# Altium schematic sheet Sheet1.SchDoc
size A3; SheetNumber: 1; SheetTotal: 1
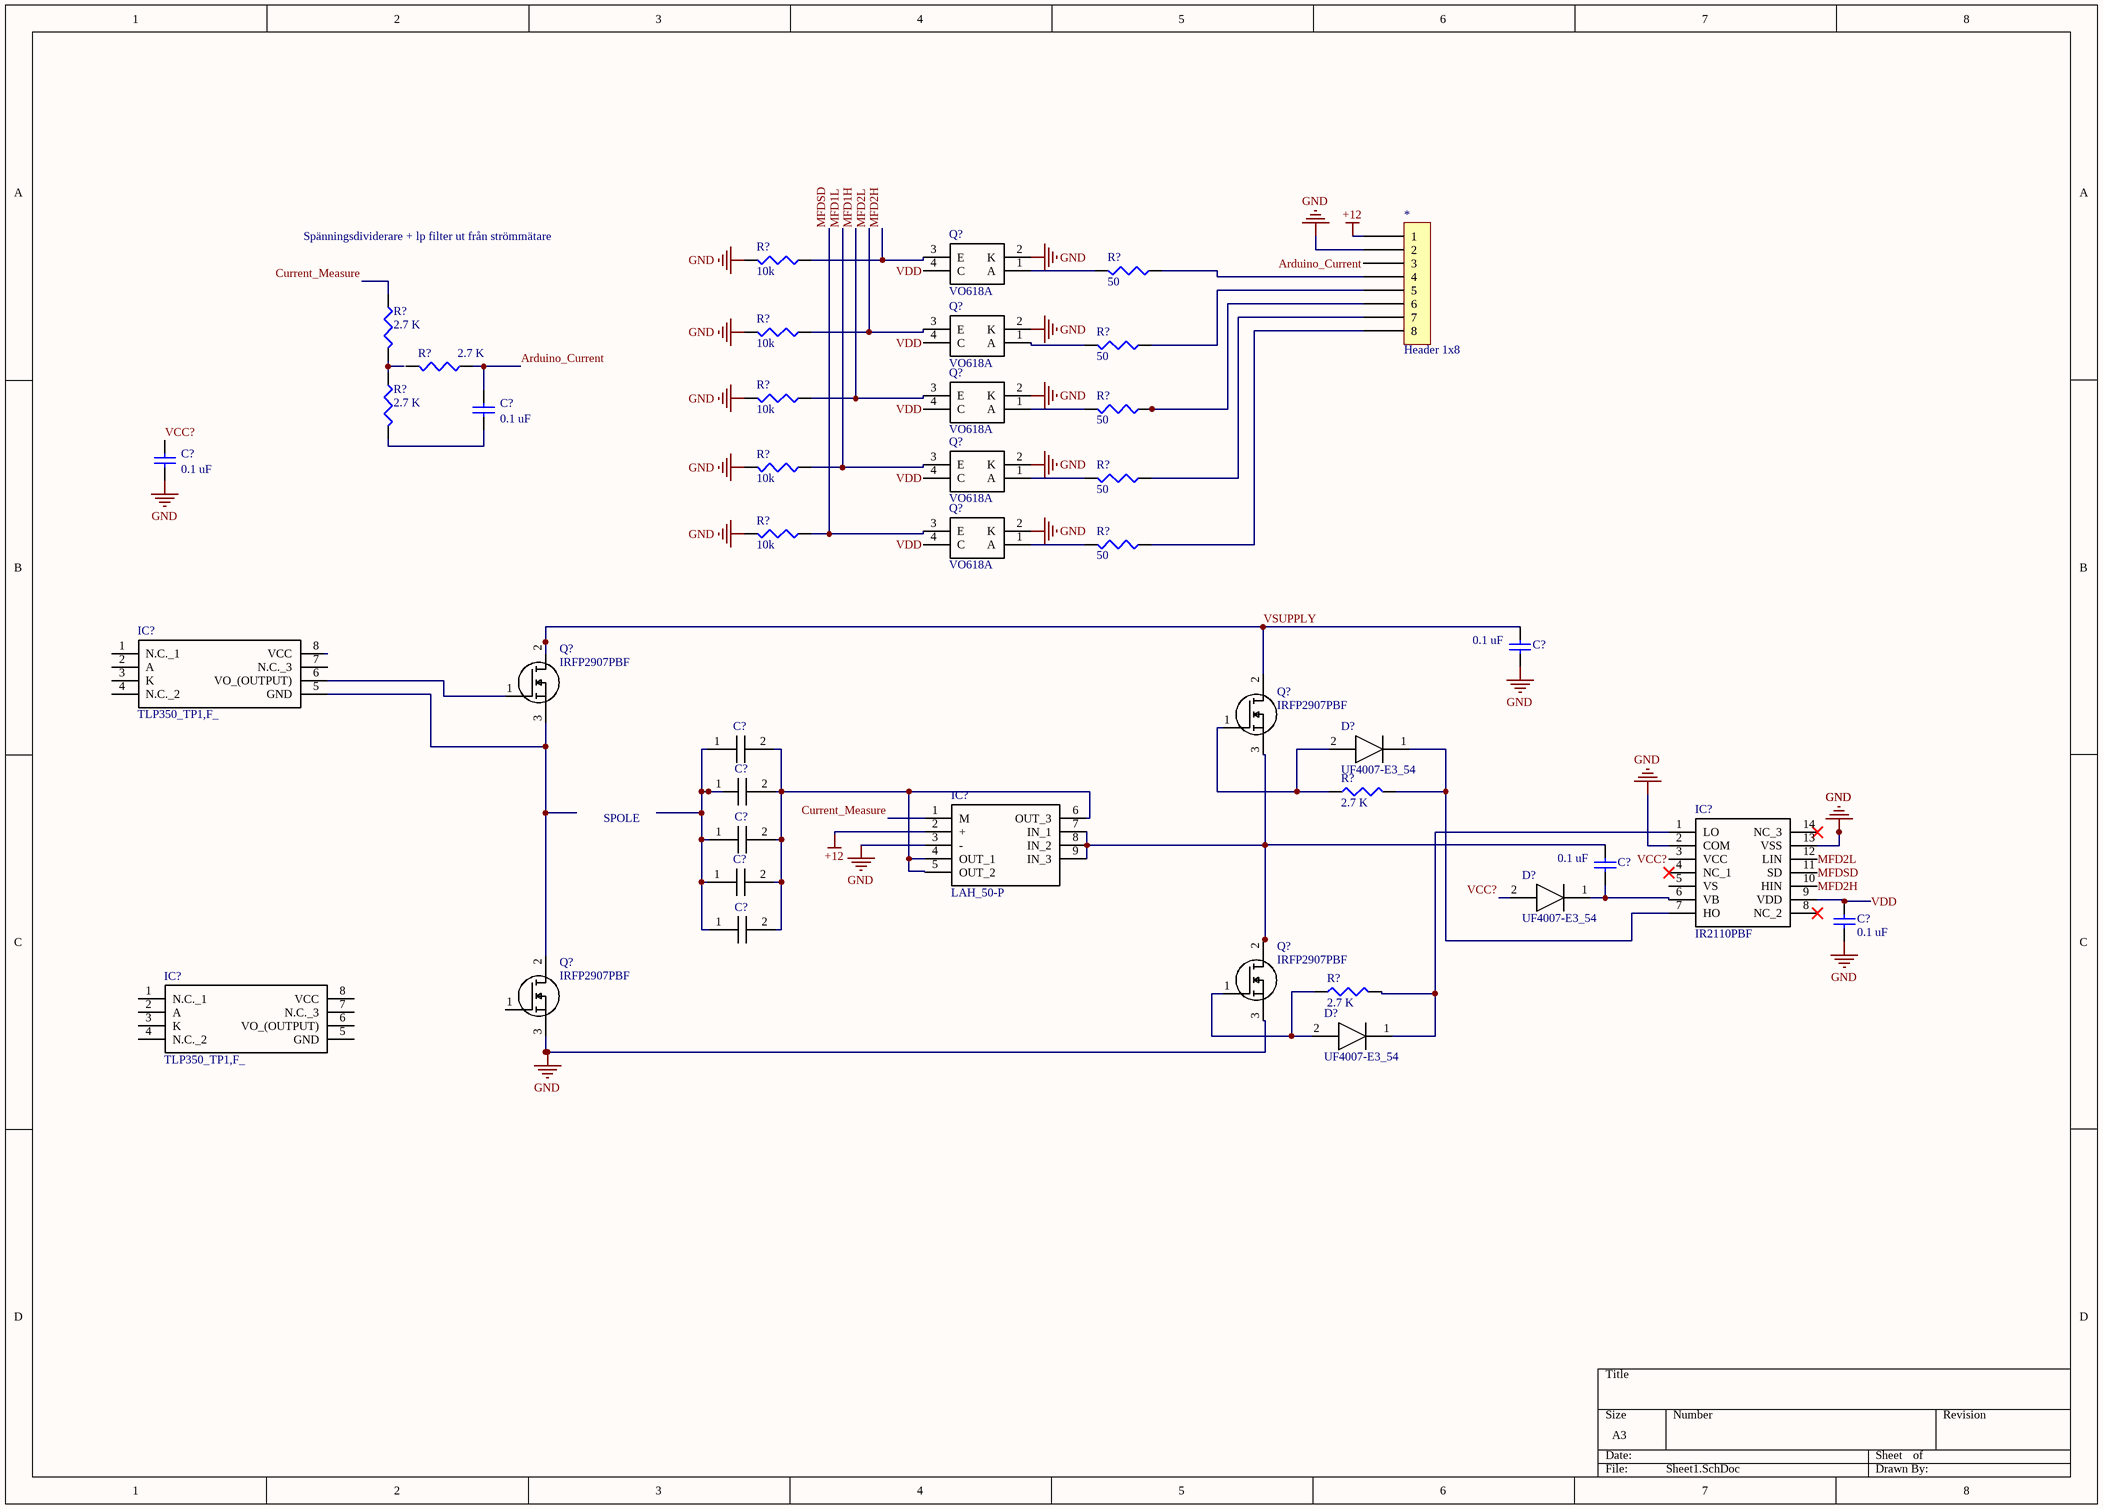
[diagram p0: Sheet1.SchDoc]

## Parts
(Parts that share a designator on the sheet are numbered #1, #2 ... from top to bottom, then left to right.)
*  Header 1x8
C?#1  0.1 uF  [6-0805_N]
C?#2  0.1 uF  [6-0805_N]
C?#3  0.1 uF  [6-0805_N]
C?#4  (no value)  [PHE845VW7100MR06L2]
C?#5  (no value)  [PHE845VW7100MR06L2]
C?#6  (no value)  [PHE845VW7100MR06L2]
C?#7  0.1 uF  [6-0805_N]
C?#8  (no value)  [PHE845VW7100MR06L2]
C?#9  0.1 uF  [6-0805_N]
C?#10  (no value)  [PHE845VW7100MR06L2]
D?#1  UF4007-E3_54  [DIOAD1405W86L465D235]
D?#2  UF4007-E3_54  [DIOAD1405W86L465D235]
D?#3  UF4007-E3_54  [DIOAD1405W86L465D235]
IC?#1  TLP350_TP1,F_  [DIP762W60P254L966H485Q8N]
IC?#2  LAH_50-P  [LAH50P]
IC?#3  IR2110PBF  [DIP761W56P254L1930H533Q14N]
IC?#4  TLP350_TP1,F_  [DIP762W60P254L966H485Q8N]
Q?#1  VO618A  [DIP762W60P254L458H430Q4N]
Q?#2  VO618A  [DIP762W60P254L458H430Q4N]
Q?#3  VO618A  [DIP762W60P254L458H430Q4N]
Q?#4  VO618A  [DIP762W60P254L458H430Q4N]
Q?#5  VO618A  [DIP762W60P254L458H430Q4N]
Q?#6  IRFP2907PBF  [TO546P531X1558X2499-3P]
Q?#7  IRFP2907PBF  [TO546P531X1558X2499-3P]
Q?#8  IRFP2907PBF  [TO546P531X1558X2499-3P]
Q?#9  IRFP2907PBF  [TO546P531X1558X2499-3P]
R?#1  value 10k  [6-0805_N]  (hidden comment: 2.7 K)
R?#2  value 50  [6-0805_N]  (hidden comment: 2.7 K)
R?#3  2.7 K  [6-0805_N]
R?#4  value 10k  [6-0805_N]  (hidden comment: 2.7 K)
R?#5  value 50  [6-0805_N]  (hidden comment: 2.7 K)
R?#6  2.7 K  [6-0805_N]
R?#7  2.7 K  [6-0805_N]
R?#8  value 10k  [6-0805_N]  (hidden comment: 2.7 K)
R?#9  value 50  [6-0805_N]  (hidden comment: 2.7 K)
R?#10  value 10k  [6-0805_N]  (hidden comment: 2.7 K)
R?#11  value 50  [6-0805_N]  (hidden comment: 2.7 K)
R?#12  value 10k  [6-0805_N]  (hidden comment: 2.7 K)
R?#13  value 50  [6-0805_N]  (hidden comment: 2.7 K)
R?#14  2.7 K  [6-0805_N]
R?#15  2.7 K  [6-0805_N]

## Nets
+12: *.1 IC?#2.2(+)
GND: *.2 C?#2.1 C?#9.2 IC?#2.3(-) IC?#3.2(COM) IC?#3.13(VSS) Q?#1.2(K) Q?#2.2(K) Q?#3.2(K) Q?#4.2(K) Q?#5.2(K) Q?#8.3(S) Q?#9.3(S) R?#1.2 R?#4.2 R?#8.2 R?#10.2 R?#12.2
Arduino_Current: *.3 C?#1.2 R?#6.1
Current_Measure: IC?#2.1(M) R?#3.1
MFD1H: Q?#3.3(E) R?#8.1
MFD1L: Q?#4.3(E) R?#10.1
MFD2H: IC?#3.10(HIN) Q?#1.3(E) R?#1.1
MFD2L: IC?#3.12(LIN) Q?#2.3(E) R?#4.1
MFDSD: IC?#3.11(SD) Q?#5.3(E) R?#12.1
VCC?: C?#2.2 D?#2.2(A) IC?#3.3(VCC)
VDD: C?#9.1 IC?#3.9(VDD) Q?#1.4(C) Q?#2.4(C) Q?#3.4(C) Q?#4.4(C) Q?#5.4(C)
VSUPPLY: C?#3.1 Q?#6.2(D) Q?#7.2(D)
Net*_4: *.4 R?#2.1
Net*_5: *.5 R?#5.1
Net*_6: *.6 R?#9.1
Net*_7: *.7 R?#11.1
Net*_8: *.8 R?#13.1
NetC?#1_1: C?#1.1 R?#7.2
NetC?#4_1: C?#4.1 C?#5.1 C?#6.1 C?#8.1 C?#10.1
NetC?#4_2: C?#4.2 C?#5.2 C?#6.2 C?#8.2 C?#10.2 IC?#2.4(OUT_1) IC?#2.5(OUT_2) IC?#2.6(OUT_3)
NetC?#7_1: C?#7.1 IC?#2.7(IN_1) IC?#2.8(IN_2) IC?#2.9(IN_3) Q?#7.3(S) Q?#8.2(D)
NetC?#7_2: C?#7.2 D?#2.1(K) IC?#3.6(VB)
NetD?#1_1: D?#1.1(K) IC?#3.7(HO) R?#14.2
NetD?#1_2: D?#1.2(A) Q?#7.1(G) R?#14.1
NetD?#3_1: D?#3.1(K) IC?#3.1(LO) R?#15.2
NetD?#3_2: D?#3.2(A) Q?#8.1(G) R?#15.1
NetIC?#1_5: IC?#1.5(GND) Q?#6.3(S) Q?#9.2(D)
NetIC?#1_6: IC?#1.6(VO_(OUTPUT)) Q?#6.1(G)
NetQ?#1_1: Q?#1.1(A) R?#2.2
NetQ?#2_1: Q?#2.1(A) R?#5.2
NetQ?#3_1: Q?#3.1(A) R?#9.2
NetQ?#4_1: Q?#4.1(A) R?#11.2
NetQ?#5_1: Q?#5.1(A) R?#13.2
NetR?#3_2: R?#3.2 R?#7.1

Not connected (* = marked no-connect by the designer): C?#3 2; IC?#1 1(N.C._1) 2(A) 3(K) 4(N.C._2) 7(N.C._3) 8(VCC); IC?#3 4(NC_1)* 5(VS) 8(NC_2)* 14(NC_3)*; IC?#4 1(N.C._1) 2(A) 3(K) 4(N.C._2) 5(GND) 6(VO_(OUTPUT)) 7(N.C._3) 8(VCC); Q?#9 1(G); R?#6 2

## Notes on the sheet
- Spänningsdividerare + lp filter ut från strömmätare
- SPOLE
- Labels drawn without touching a wire or pin: GND

## Library data of the parts
C?#1-C?#3 C?#7 C?#9 = Cap Semi: Capacitor (Semiconductor SIM Model); Value: 100nF; Published: 8-Jun-2000; LatestRevisionDate: 29-May-2009; LatestRevisionNote: IPC-7351 Footprint Added.; PackageReference: C1206; Publisher: Altium Limited; PackageDescription: Chip Capacitor
C?#4-C?#6 C?#8 C?#10 = PHE845VW7100MR06L2: Capacitor; Manufacturer_Name: KEMET; Datasheet Link: https://www.kemet.com/specsheet/F845RP105M760C; Height: 38mm; Manufacturer_Part_Number: PHE845VW7100MR06L2; Mouser Part Number: 80-PHE845VW7100MR6L2; Mouser Price/Stock: https://www.mouser.com/Search/Refine.aspx?Keyword=80-PHE845VW7100MR6L2
D?#1-D?#3 = UF4007-E3_54: Diode; Manufacturer_Name: Vishay; Manufacturer_Part_Number: UF4007-E3/54; Datasheet Link: https://componentsearchengine.com/Datasheets/1/UF4007-E3_54.pdf; Mouser Part Number: 625-UF4007-E3; Mouser Price/Stock: https://www.mouser.co.uk/ProductDetail/Vishay-General-Semiconductor/UF4007-E3-54?qs=D6r9GjgEnNO74IquQywOzA%3D%3D; Arrow Part Number: UF4007-E3/54; Arrow Price/Stock: https://www.arrow.com/en/products/uf4007-e354/vishay?region=europe
IC?#1 IC?#4 = TLP350_TP1,F_: Integrated Circuit; Manufacturer_Name: Toshiba; Manufacturer_Part_Number: TLP350(TP1,F); Datasheet Link: https://toshiba.semicon-storage.com/info/docget.jsp?did=6217&prodName=TLP350; Height: 4.85mm; Mouser Part Number: 757-TLP350(TP1,F); Mouser Price/Stock: https://www.mouser.co.uk/ProductDetail/Toshiba/TLP350TP1F?qs=f0GatGUIxV3mNWWzK5NBiQ%3D%3D; Arrow Part Number: TLP350(TP1,F); Arrow Price/Stock: https://www.arrow.com/en/products/tlp350-tp1f/toshiba?region=asia
IC?#2 = LAH_50-P: Integrated Circuit; Manufacturer_Name: LEM; Manufacturer_Part_Number: LAH 50-P; Datasheet Link: https://www.lem.com/sites/default/files/products_datasheets/lah_50-p.pdf; Height: 21.15mm
IC?#3 = IR2110PBF: Integrated Circuit; Manufacturer_Name: Infineon; Datasheet Link: https://www.infineon.com/cms/en/product/power/gate-driver-ics/?; Height: 5.33mm; Manufacturer_Part_Number: IR2110PBF; Mouser Part Number: 942-IR2110PBF; Mouser Price/Stock: https://www.mouser.co.uk/ProductDetail/Infineon-Technologies/IR2110PBF?qs=2r01AXMCG3MulUIzmlbKYw%3D%3D; Arrow Part Number: IR2110PBF; Arrow Price/Stock: https://www.arrow.com/en/products/ir2110pbf/infineon-technologies-ag?region=nac
Q?#1-Q?#5 = VO618A: Transistor; Manufacturer_Name: Vishay; Datasheet Link: https://www.vishay.com/docs/83432/vo618a.pdf; Height: 4.3mm; Manufacturer_Part_Number: VO618A; Mouser Part Number: 78-VO618A; Mouser Price/Stock: https://www.mouser.co.uk/ProductDetail/Vishay-Semiconductors/VO618A?qs=s4XK1XdnRik%2FNX5a1Rh4WQ%3D%3D; Arrow Part Number: VO618A; Arrow Price/Stock: https://www.arrow.com/en/products/vo618a/vishay?region=nac
Q?#6-Q?#9 = IRFP2907PBF: MOSFET (N-Channel); Manufacturer_Name: Infineon; Datasheet Link: https://www.infineon.com/dgdl/irfp2907pbf.pdf?fileId=5546d462533600a401535628b2d51fe8; Height: 5.31mm; Manufacturer_Part_Number: IRFP2907PBF; Mouser Part Number: 942-IRFP2907PBF; Mouser Price/Stock: https://www.mouser.co.uk/ProductDetail/Infineon-IR/IRFP2907PBF?qs=XgnB68EmdM1ZjadeHZwM5g%3D%3D; Arrow Part Number: IRFP2907PBF; Arrow Price/Stock: https://www.arrow.com/en/products/irfp2907pbf/infineon-technologies-ag
R?#1-R?#15 = Res3: Resistor; Published: 8-Jun-2000; LatestRevisionDate: 29-May-2009; LatestRevisionNote: IPC-7351 Footprint Added.; PackageReference: J1-0603; Publisher: Altium Limited; PackageDescription: Chip Resistor
  R?#3 R?#6 R?#7 R?#14 R?#15: Value: 2.7 K